# EasyEDA schematic SCH_Robot-Transporter_2025-06-01.json
TITLE: Sheet_1; REV: 1.0; Date: 2025-05-30; Sheet: 1/1; Drawn By: farilwijanarko123; Company: Your Company
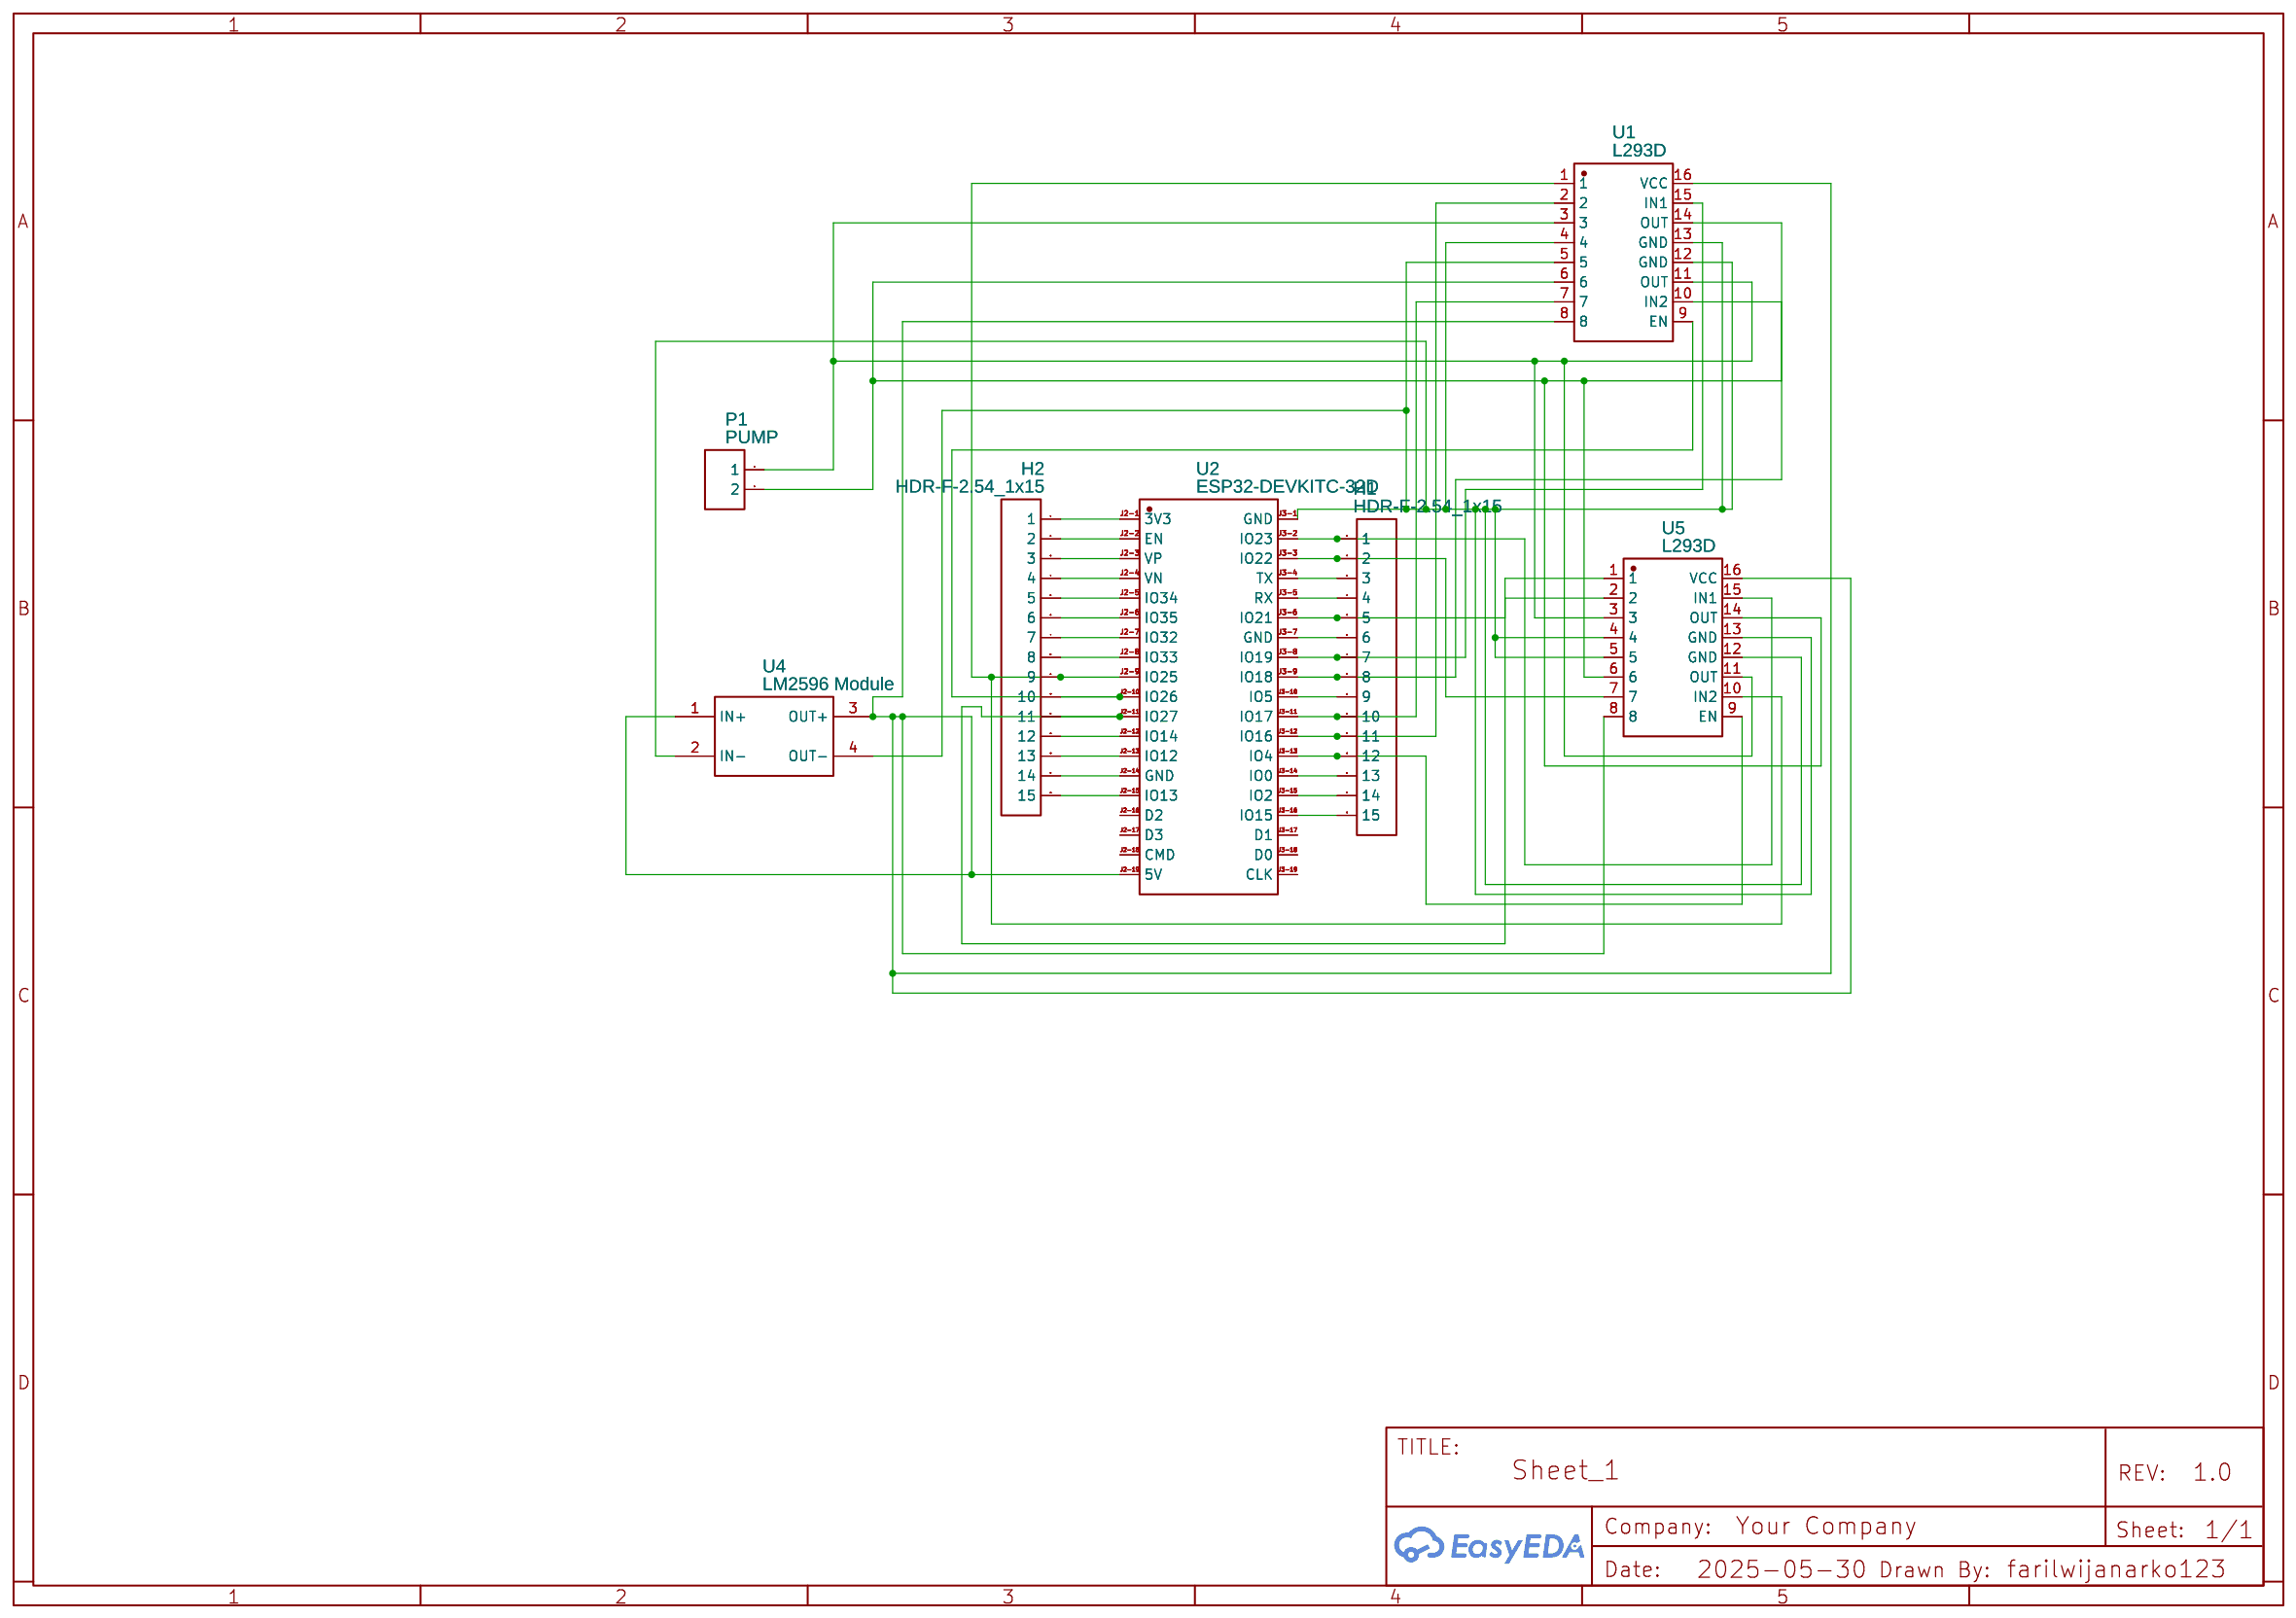
[diagram p0: schematic sheet]

## Parts
H1  HDR-F-2.54_1x15  [HDR-F-2.54_1X15]
H2  HDR-F-2.54_1x15  [HDR-F-2.54_1X15]
P1  PUMP  [CONN-TH_2P-P5.00]
U1  L293D  [L293D]
U2  ESP32-DEVKITC-32D  [COMM-SMD_ESP32-DEVKITC-32D]
U4  LM2596 Module  [LM2596-MODULE]
U5  L293D  [L293D]

## Library data of the parts
H1 H2 = HDR-F-2.54_1x15: Supplier Part: C124408; Supplier: LCSC; Contributor: LCEDA_Lib
P1 = CONN-TH_2P-P5.00: Supplier: LCSC; Contributor: Ickooo
U1 U5 = L293D: Contributor: teptical1
U2 = ESP32-DEVKITC-32D: Supplier: LCSC; Supplier Part: C571181; Manufacturer: ESPRESSIF(乐鑫); Manufacturer Part: ESP32-DevKitC-32D; JLCPCB Part Class: Extended Part; Contributor: lcsc
U4 = LM2596 Module: Contributor: VenomUA

## Nets
Net-(H1-1): H1.1 U2.J3-2(IO23) U5.15(IN1)
Net-(H1-2): H1.2 U2.J3-3(IO22) U5.7
Net-(H1-3): H1.3 U2.J3-4(TX)
Net-(H1-4): H1.4 U2.J3-5(RX)
Net-(H1-5): H1.5 U2.J3-6(IO21) U5.2
Net-(H1-6): H1.6 U2.J3-7(GND)
Net-(H1-7): H1.7 U1.15(IN1) U2.J3-8(IO19)
Net-(H1-8): H1.8 U1.10(IN2) U2.J3-9(IO18)
Net-(H1-9): H1.9 U2.J3-10(IO5)
Net-(H1-10): H1.10 U1.7 U2.J3-11(IO17)
Net-(H1-11): H1.11 U1.2 U2.J3-12(IO16)
Net-(H1-12): H1.12 U2.J3-13(IO4) U5.9(EN)
Net-(H1-13): H1.13 U2.J3-14(IO0)
Net-(H1-14): H1.14 U2.J3-15(IO2)
Net-(H1-15): H1.15 U2.J3-16(IO15)
Net-(H2-1): H2.1 U2.J2-1(3V3)
Net-(H2-2): H2.2 U2.J2-2(EN)
Net-(H2-3): H2.3 U2.J2-3(VP)
Net-(H2-4): H2.4 U2.J2-4(VN)
Net-(H2-5): H2.5 U2.J2-5(IO34)
Net-(H2-6): H2.6 U2.J2-6(IO35)
Net-(H2-7): H2.7 U2.J2-7(IO32)
Net-(H2-8): H2.8 U2.J2-8(IO33)
Net-(H2-9): H2.9 U1.1 U2.J2-9(IO25) U5.10(IN2)
Net-(H2-10): H2.10 U1.9(EN) U2.J2-10(IO26)
Net-(H2-11): H2.11 U2.J2-11(IO27) U5.1
Net-(H2-12): H2.12 U2.J2-12(IO14)
Net-(H2-13): H2.13 U2.J2-13(IO12)
Net-(H2-14): H2.14 U2.J2-14(GND)
Net-(H2-15): H2.15 U2.J2-15(IO13)
Net-(P1-1): P1.1 U1.3 U1.11(OUT) U5.3 U5.11(OUT)
Net-(P1-2): P1.2 U1.6 U1.14(OUT) U5.6 U5.14(OUT)
Net-(U1-4): U1.4 U1.5 U1.12(GND) U1.13(GND) U2.J3-1(GND) U4.2(IN-) U4.4(OUT-) U5.4 U5.5 U5.12(GND) U5.13(GND)
Net-(U1-8): U1.8 U1.16(VCC) U2.J2-19(5V) U4.1(IN+) U4.3(OUT+) U5.8 U5.16(VCC)

Not connected (* = marked no-connect by the designer): U2 J2-16(D2) J2-17(D3) J2-18(CMD) J3-17(D1) J3-18(D0) J3-19(CLK)
